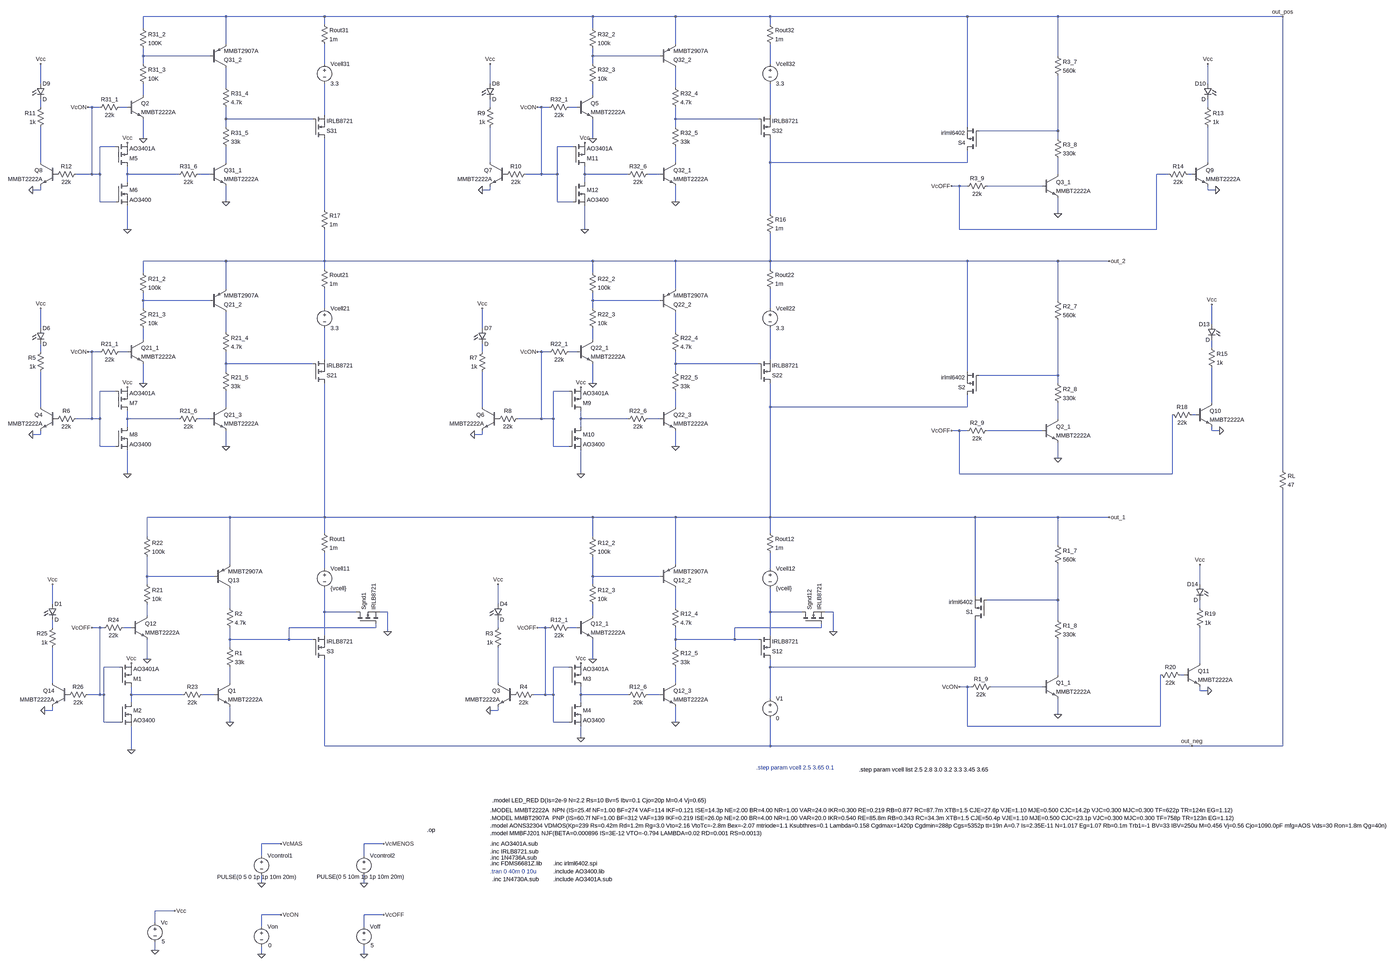
[diagram p0: schematic version_3x2.asc, whole sheet]
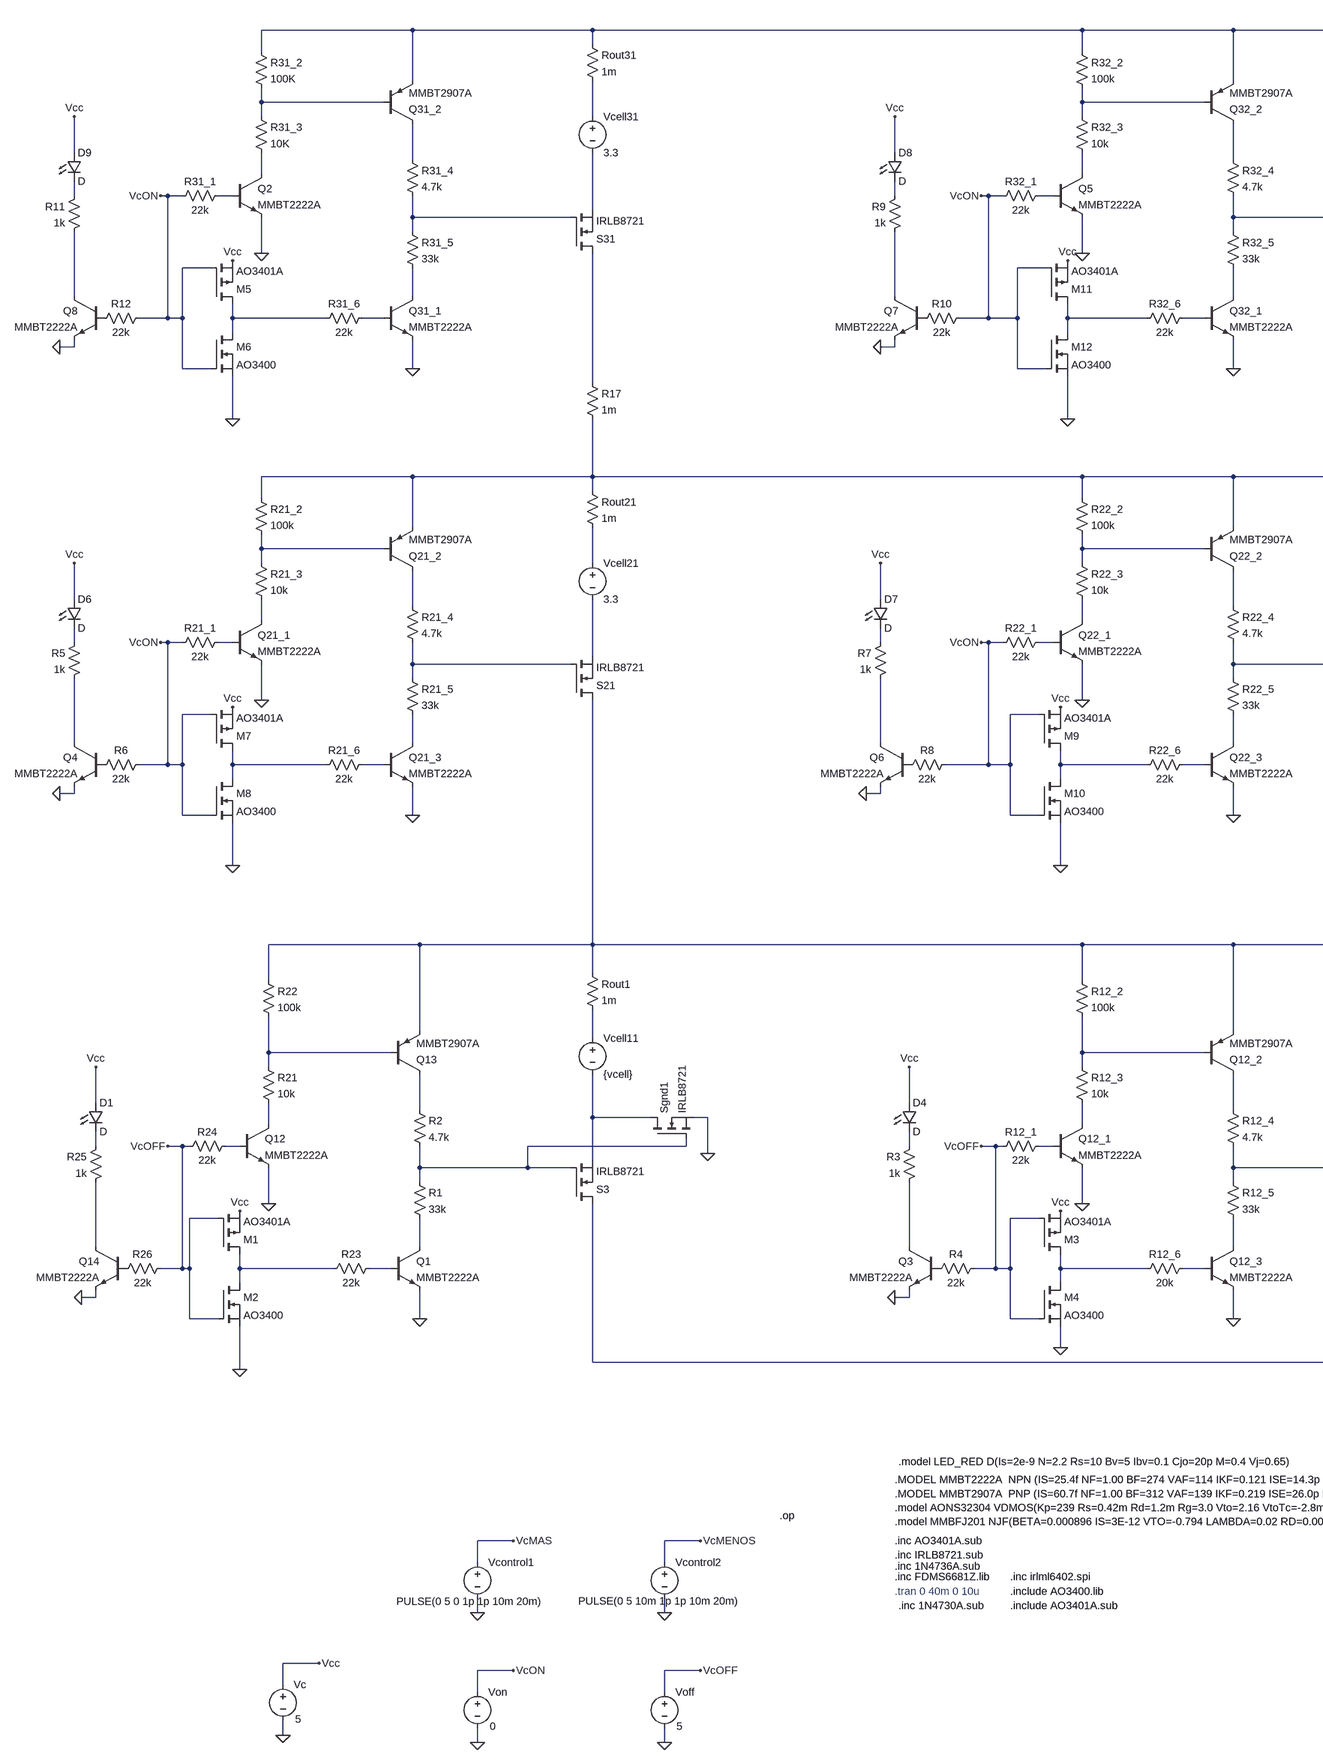
[diagram p1: schematic version_3x2.asc, part, row 1 of 1, column 1 of 2]
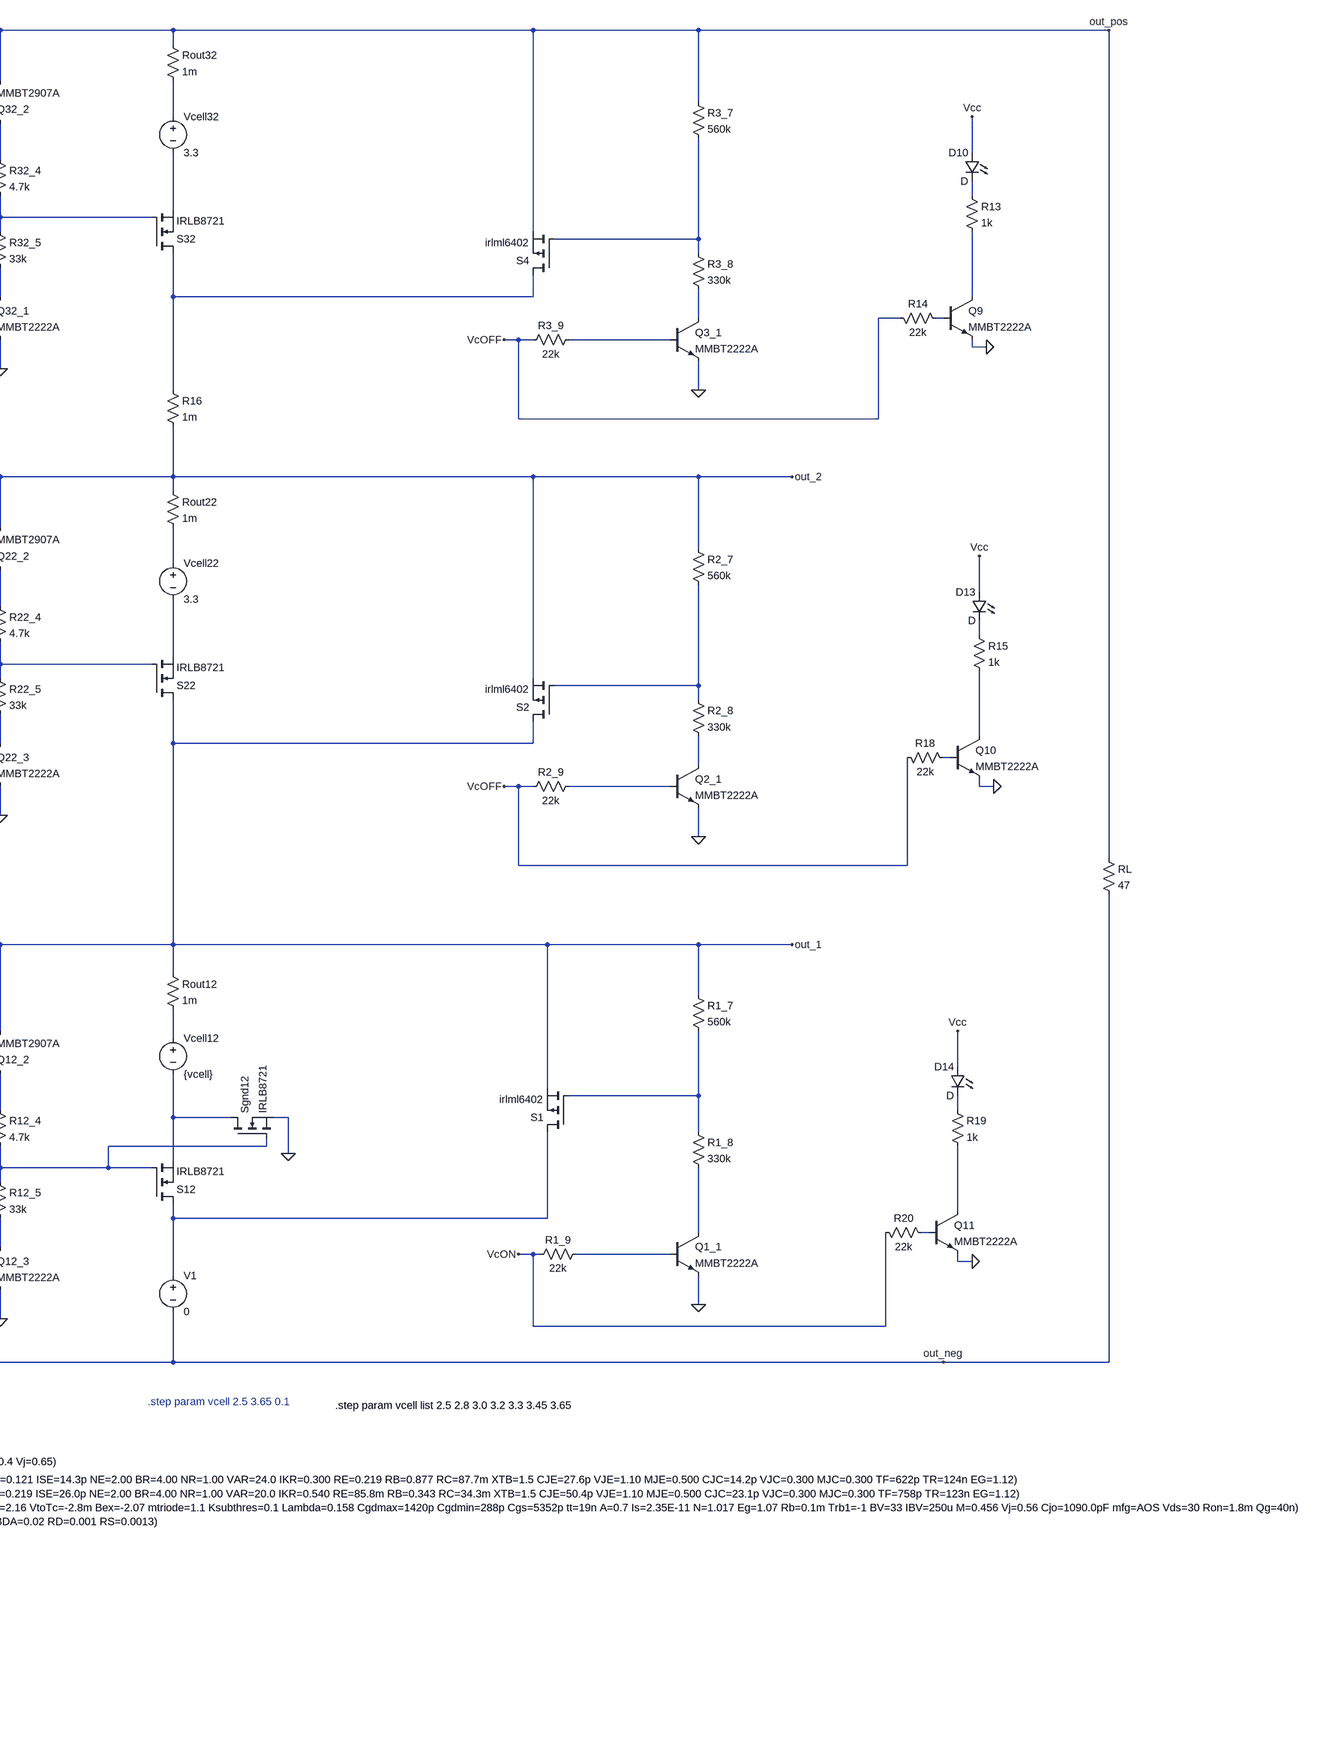
[diagram p2: schematic version_3x2.asc, part, row 1 of 1, column 2 of 2]
version_3x2.asc, the LTspice schematic file:
Version 4.1
SHEET 1 7672 2128
WIRE -1296 -2512 -1632 -2512
WIRE -896 -2512 -1296 -2512
WIRE 192 -2512 -896 -2512
WIRE 528 -2512 192 -2512
WIRE 912 -2512 528 -2512
WIRE 1712 -2512 912 -2512
WIRE 2080 -2512 1712 -2512
WIRE 2992 -2512 2080 -2512
WIRE -896 -2480 -896 -2512
WIRE 912 -2480 912 -2512
WIRE -1632 -2464 -1632 -2512
WIRE 192 -2464 192 -2512
WIRE -1296 -2400 -1296 -2512
WIRE 528 -2400 528 -2512
WIRE -1632 -2352 -1632 -2384
WIRE -1360 -2352 -1632 -2352
WIRE 192 -2352 192 -2384
WIRE 464 -2352 192 -2352
WIRE 2080 -2352 2080 -2512
WIRE -1632 -2320 -1632 -2352
WIRE -896 -2320 -896 -2400
WIRE 192 -2320 192 -2352
WIRE 912 -2320 912 -2400
WIRE -2048 -2240 -2048 -2320
WIRE -224 -2240 -224 -2320
WIRE 2688 -2240 2688 -2320
WIRE -1296 -2224 -1296 -2304
WIRE 528 -2224 528 -2304
WIRE -1632 -2192 -1632 -2240
WIRE 192 -2192 192 -2240
WIRE -2048 -2144 -2048 -2176
WIRE -1840 -2144 -1856 -2144
WIRE -1808 -2144 -1840 -2144
WIRE -1696 -2144 -1728 -2144
WIRE -224 -2144 -224 -2176
WIRE -16 -2144 -32 -2144
WIRE 16 -2144 -16 -2144
WIRE 128 -2144 96 -2144
WIRE 2688 -2144 2688 -2176
WIRE -896 -2112 -896 -2240
WIRE 912 -2112 912 -2240
WIRE -1296 -2096 -1296 -2144
WIRE -944 -2096 -1296 -2096
WIRE 528 -2096 528 -2144
WIRE 864 -2096 528 -2096
WIRE -1296 -2064 -1296 -2096
WIRE 528 -2064 528 -2096
WIRE 1712 -2064 1712 -2512
WIRE 2080 -2048 2080 -2272
WIRE 2080 -2048 1760 -2048
WIRE -1632 -2016 -1632 -2096
WIRE 192 -2016 192 -2096
WIRE 2080 -2016 2080 -2048
WIRE -1744 -1984 -1808 -1984
WIRE 112 -1984 48 -1984
WIRE -2048 -1920 -2048 -2064
WIRE -1296 -1920 -1296 -1984
WIRE -224 -1920 -224 -2064
WIRE 528 -1920 528 -1984
WIRE 912 -1920 912 -2016
WIRE 1712 -1920 1712 -1968
WIRE 1712 -1920 912 -1920
WIRE 2688 -1920 2688 -2064
WIRE -1840 -1872 -1840 -2144
WIRE -1840 -1872 -1904 -1872
WIRE -1808 -1872 -1808 -1984
WIRE -1808 -1872 -1840 -1872
WIRE -1696 -1872 -1696 -1904
WIRE -1488 -1872 -1696 -1872
WIRE -1360 -1872 -1408 -1872
WIRE -16 -1872 -16 -2144
WIRE -16 -1872 -80 -1872
WIRE 48 -1872 48 -1984
WIRE 48 -1872 -16 -1872
WIRE 160 -1872 160 -1904
WIRE 336 -1872 160 -1872
WIRE 464 -1872 416 -1872
WIRE 2080 -1872 2080 -1936
WIRE 2528 -1872 2480 -1872
WIRE 2624 -1872 2608 -1872
WIRE -1696 -1840 -1696 -1872
WIRE 160 -1840 160 -1872
WIRE 1680 -1824 1648 -1824
WIRE 1712 -1824 1680 -1824
WIRE 2016 -1824 1792 -1824
WIRE -2048 -1808 -2048 -1824
WIRE -2048 -1808 -2080 -1808
WIRE -224 -1808 -224 -1824
WIRE -224 -1808 -256 -1808
WIRE 2688 -1808 2688 -1824
WIRE 2720 -1808 2688 -1808
WIRE -1808 -1760 -1808 -1872
WIRE -1744 -1760 -1808 -1760
WIRE -1296 -1760 -1296 -1824
WIRE 48 -1760 48 -1872
WIRE 112 -1760 48 -1760
WIRE 528 -1760 528 -1824
WIRE -896 -1728 -896 -2016
WIRE 912 -1712 912 -1920
WIRE 2080 -1712 2080 -1776
WIRE -1696 -1648 -1696 -1744
WIRE 160 -1648 160 -1744
WIRE 1680 -1648 1680 -1824
WIRE 2480 -1648 2480 -1872
WIRE 2480 -1648 1680 -1648
WIRE -1296 -1456 -1632 -1456
WIRE -896 -1456 -896 -1648
WIRE -896 -1456 -1296 -1456
WIRE 192 -1456 -896 -1456
WIRE 528 -1456 192 -1456
WIRE 912 -1456 912 -1632
WIRE 912 -1456 528 -1456
WIRE 1712 -1456 912 -1456
WIRE 2080 -1456 1712 -1456
WIRE 2288 -1456 2080 -1456
WIRE -896 -1424 -896 -1456
WIRE 912 -1424 912 -1456
WIRE -1632 -1408 -1632 -1456
WIRE 192 -1408 192 -1456
WIRE -1296 -1344 -1296 -1456
WIRE 528 -1344 528 -1456
WIRE -1632 -1296 -1632 -1328
WIRE -1360 -1296 -1632 -1296
WIRE 192 -1296 192 -1328
WIRE 464 -1296 192 -1296
WIRE 2080 -1296 2080 -1456
WIRE -1632 -1264 -1632 -1296
WIRE -896 -1264 -896 -1344
WIRE 192 -1264 192 -1296
WIRE 912 -1264 912 -1344
WIRE 2704 -1200 2704 -1280
WIRE -2048 -1184 -2048 -1264
WIRE -256 -1184 -256 -1264
WIRE -1296 -1168 -1296 -1248
WIRE 528 -1168 528 -1248
WIRE -1632 -1136 -1632 -1184
WIRE 192 -1136 192 -1184
WIRE 2704 -1104 2704 -1136
WIRE -2048 -1088 -2048 -1120
WIRE -1840 -1088 -1856 -1088
WIRE -1808 -1088 -1840 -1088
WIRE -1696 -1088 -1728 -1088
WIRE -256 -1088 -256 -1120
WIRE -16 -1088 -32 -1088
WIRE 16 -1088 -16 -1088
WIRE 128 -1088 96 -1088
WIRE -896 -1056 -896 -1184
WIRE 912 -1056 912 -1184
WIRE -1296 -1040 -1296 -1088
WIRE -944 -1040 -1296 -1040
WIRE 528 -1040 528 -1088
WIRE 864 -1040 528 -1040
WIRE -1296 -1008 -1296 -1040
WIRE 528 -1008 528 -1040
WIRE 1712 -1008 1712 -1456
WIRE 2080 -992 2080 -1216
WIRE 2080 -992 1760 -992
WIRE -1632 -960 -1632 -1040
WIRE 192 -960 192 -1040
WIRE 2080 -960 2080 -992
WIRE -1744 -928 -1808 -928
WIRE 96 -928 32 -928
WIRE 2704 -880 2704 -1024
WIRE -2048 -864 -2048 -1008
WIRE -1296 -864 -1296 -928
WIRE -256 -864 -256 -1008
WIRE 528 -864 528 -928
WIRE 912 -864 912 -960
WIRE 1712 -864 1712 -912
WIRE 1712 -864 912 -864
WIRE 2640 -832 2624 -832
WIRE -1840 -816 -1840 -1088
WIRE -1840 -816 -1904 -816
WIRE -1808 -816 -1808 -928
WIRE -1808 -816 -1840 -816
WIRE -1696 -816 -1696 -848
WIRE -1488 -816 -1696 -816
WIRE -1360 -816 -1408 -816
WIRE -16 -816 -16 -1088
WIRE -16 -816 -112 -816
WIRE 32 -816 32 -928
WIRE 32 -816 -16 -816
WIRE 144 -816 144 -848
WIRE 336 -816 144 -816
WIRE 464 -816 416 -816
WIRE 2080 -816 2080 -880
WIRE -1696 -784 -1696 -816
WIRE 144 -784 144 -816
WIRE 1680 -768 1648 -768
WIRE 1712 -768 1680 -768
WIRE 2016 -768 1792 -768
WIRE 2704 -768 2704 -784
WIRE 2736 -768 2704 -768
WIRE -2048 -752 -2048 -768
WIRE -2048 -752 -2080 -752
WIRE -256 -752 -256 -768
WIRE -256 -752 -288 -752
WIRE -1808 -704 -1808 -816
WIRE -1744 -704 -1808 -704
WIRE -1296 -704 -1296 -768
WIRE 32 -704 32 -816
WIRE 96 -704 32 -704
WIRE 528 -704 528 -768
WIRE 2080 -656 2080 -720
WIRE 2992 -608 2992 -2512
WIRE -1696 -592 -1696 -688
WIRE 144 -592 144 -688
WIRE 1680 -592 1680 -768
WIRE 2544 -592 2544 -832
WIRE 2544 -592 1680 -592
WIRE -1280 -368 -1616 -368
WIRE -896 -368 -896 -960
WIRE -896 -368 -1280 -368
WIRE 192 -368 -896 -368
WIRE 528 -368 192 -368
WIRE 912 -368 912 -864
WIRE 912 -368 528 -368
WIRE 1744 -368 912 -368
WIRE 2080 -368 1744 -368
WIRE 2288 -368 2080 -368
WIRE -896 -304 -896 -368
WIRE 912 -304 912 -368
WIRE -1616 -288 -1616 -368
WIRE 192 -288 192 -368
WIRE 2080 -256 2080 -368
WIRE -1280 -176 -1280 -368
WIRE 528 -176 528 -368
WIRE -896 -160 -896 -224
WIRE 912 -160 912 -224
WIRE -1616 -128 -1616 -208
WIRE -1344 -128 -1616 -128
WIRE 192 -128 192 -208
WIRE 464 -128 192 -128
WIRE -1616 -96 -1616 -128
WIRE 192 -96 192 -128
WIRE 2656 -96 2656 -176
WIRE 1744 -48 1744 -368
WIRE 2080 -32 2080 -176
WIRE 2080 -32 1792 -32
WIRE -2000 -16 -2000 -96
WIRE -192 -16 -192 -96
WIRE -1280 0 -1280 -80
WIRE 528 0 528 -80
WIRE 2656 0 2656 -32
WIRE -896 16 -896 -80
WIRE -768 16 -896 16
WIRE -640 16 -672 16
WIRE 912 16 912 -80
WIRE 1040 16 912 16
WIRE 1168 16 1136 16
WIRE -1616 32 -1616 -16
WIRE 192 32 192 -16
WIRE 2080 48 2080 -32
WIRE -2000 80 -2000 48
WIRE -1808 80 -1840 80
WIRE -1792 80 -1808 80
WIRE -1680 80 -1712 80
WIRE -688 80 -688 64
WIRE -688 80 -1040 80
WIRE -192 80 -192 48
WIRE 0 80 -32 80
WIRE 16 80 0 80
WIRE 128 80 96 80
WIRE 1120 80 1120 64
WIRE 1120 80 768 80
WIRE -640 96 -640 16
WIRE 1168 96 1168 16
WIRE -896 112 -896 16
WIRE 912 112 912 16
WIRE -1280 128 -1280 80
WIRE -1040 128 -1040 80
WIRE -1040 128 -1280 128
WIRE -944 128 -1040 128
WIRE 528 128 528 80
WIRE 768 128 768 80
WIRE 768 128 528 128
WIRE 864 128 768 128
WIRE -1280 160 -1280 128
WIRE 528 160 528 128
WIRE -1616 208 -1616 128
WIRE 192 208 192 128
WIRE 2656 224 2656 80
WIRE -1728 240 -1792 240
WIRE 96 240 32 240
WIRE 912 240 912 208
WIRE 1744 240 1744 48
WIRE 1744 240 912 240
WIRE 2080 272 2080 128
WIRE 2592 272 2576 272
WIRE -2000 304 -2000 160
WIRE -1280 304 -1280 240
WIRE -192 304 -192 160
WIRE 528 304 528 240
WIRE 1712 320 1680 320
WIRE 1728 320 1712 320
WIRE 2016 320 1808 320
WIRE 2656 336 2656 320
WIRE 2688 336 2656 336
WIRE -1808 352 -1808 80
WIRE -1808 352 -1856 352
WIRE -1792 352 -1792 240
WIRE -1792 352 -1808 352
WIRE -1680 352 -1680 320
WIRE -1472 352 -1680 352
WIRE -1344 352 -1392 352
WIRE 0 352 0 80
WIRE 0 352 -48 352
WIRE 32 352 32 240
WIRE 32 352 0 352
WIRE 144 352 144 320
WIRE 336 352 144 352
WIRE 464 352 416 352
WIRE 912 368 912 240
WIRE -1680 384 -1680 352
WIRE 144 384 144 352
WIRE -2000 416 -2000 400
WIRE -2000 416 -2032 416
WIRE -192 416 -192 400
WIRE -192 416 -224 416
WIRE 2080 432 2080 368
WIRE -1792 464 -1792 352
WIRE -1728 464 -1792 464
WIRE -1280 464 -1280 400
WIRE 32 464 32 352
WIRE 96 464 32 464
WIRE 528 464 528 400
WIRE 1712 480 1712 320
WIRE 2496 480 2496 272
WIRE 2496 480 1712 480
WIRE 144 528 144 480
WIRE -896 560 -896 208
WIRE 912 560 912 448
WIRE 912 560 -896 560
WIRE 2624 560 912 560
WIRE 2992 560 2992 -528
WIRE 2992 560 2624 560
WIRE -1680 576 -1680 480
WIRE -1072 1024 -1152 1024
WIRE -656 1024 -736 1024
WIRE -1152 1072 -1152 1024
WIRE -736 1072 -736 1024
WIRE -1152 1184 -1152 1152
WIRE -736 1184 -736 1152
WIRE -1504 1296 -1584 1296
WIRE -1072 1312 -1152 1312
WIRE -656 1312 -736 1312
WIRE -1584 1344 -1584 1296
WIRE -1152 1360 -1152 1312
WIRE -736 1360 -736 1312
WIRE -1584 1456 -1584 1424
WIRE -1152 1472 -1152 1440
WIRE -736 1472 -736 1440
FLAG 192 208 0
FLAG 528 464 0
FLAG -1632 -960 0
FLAG -1296 -704 0
FLAG 192 -960 0
FLAG 528 -704 0
FLAG -1152 1184 0
FLAG -736 1184 0
FLAG -1072 1024 VcMAS
FLAG -656 1024 VcMENOS
FLAG -736 1472 0
FLAG -656 1312 VcOFF
FLAG -1152 1472 0
FLAG -1072 1312 VcON
FLAG -1856 -1088 VcON
FLAG -32 -1088 VcON
FLAG -32 80 VcOFF
FLAG 2624 560 out_neg
FLAG 2288 -368 out_1
FLAG 2080 432 0
FLAG 1680 320 VcON
FLAG 2080 -656 0
FLAG 1648 -768 VcOFF
FLAG 2992 -2512 out_pos
FLAG 1168 96 0
FLAG -1632 -2016 0
FLAG -1296 -1760 0
FLAG 192 -2016 0
FLAG 528 -1760 0
FLAG -1856 -2144 VcON
FLAG -32 -2144 VcON
FLAG 2080 -1712 0
FLAG 1648 -1824 VcOFF
FLAG 2288 -1456 out_2
FLAG -224 416 0
FLAG -2080 -752 0
FLAG -288 -752 0
FLAG -256 -1808 0
FLAG -2080 -1808 0
FLAG 2720 -1808 0
FLAG 2736 -768 0
FLAG 2688 336 0
FLAG 2656 -176 Vcc
FLAG -192 -96 Vcc
FLAG -256 -1264 Vcc
FLAG -2048 -1264 Vcc
FLAG 2704 -1280 Vcc
FLAG 2688 -2320 Vcc
FLAG -224 -2320 Vcc
FLAG -2048 -2320 Vcc
FLAG -1616 208 0
FLAG -1280 464 0
FLAG -1840 80 VcOFF
FLAG -640 96 0
FLAG -2032 416 0
FLAG -2000 -96 Vcc
FLAG -1680 576 0
FLAG -1680 224 Vcc
FLAG -1584 1456 0
FLAG -1504 1296 Vcc
FLAG 144 528 0
FLAG 144 224 Vcc
FLAG -1696 -1648 0
FLAG -1696 -2000 Vcc
FLAG -1696 -592 0
FLAG -1696 -944 Vcc
FLAG 144 -592 0
FLAG 144 -944 Vcc
FLAG 160 -1648 0
FLAG 160 -2000 Vcc
SYMBOL npn 464 304 R0
SYMATTR InstName Q12_3
SYMATTR Value MMBT2222A
SYMBOL res 512 144 R0
SYMATTR InstName R12_5
SYMATTR Value 33k
SYMBOL res 512 -16 R0
SYMATTR InstName R12_4
SYMATTR Value 4.7k
SYMBOL npn 128 32 R0
SYMATTR InstName Q12_1
SYMATTR Value MMBT2222A
SYMBOL res 176 -112 R0
SYMATTR InstName R12_3
SYMATTR Value 10k
SYMBOL res 176 -304 R0
SYMATTR InstName R12_2
SYMATTR Value 100k
SYMBOL res 432 336 R90
WINDOW 0 0 56 VBottom 2
WINDOW 3 32 56 VTop 2
SYMATTR InstName R12_6
SYMATTR Value 20k
SYMBOL voltage 912 -176 R0
WINDOW 123 0 0 Left 0
WINDOW 39 0 0 Left 0
SYMATTR InstName Vcell12
SYMATTR Value {vcell}
SYMBOL pnp 464 -80 M180
SYMATTR InstName Q12_2
SYMATTR Value MMBT2907A
SYMBOL nmos 864 208 M180
SYMATTR InstName S12
SYMATTR Value IRLB8721
SYMATTR Prefix X
SYMBOL npn -1360 -864 R0
SYMATTR InstName Q21_3
SYMATTR Value MMBT2222A
SYMBOL res -1312 -1024 R0
SYMATTR InstName R21_5
SYMATTR Value 33k
SYMBOL res -1312 -1184 R0
SYMATTR InstName R21_4
SYMATTR Value 4.7k
SYMBOL npn -1696 -1136 R0
SYMATTR InstName Q21_1
SYMATTR Value MMBT2222A
SYMBOL res -1648 -1280 R0
SYMATTR InstName R21_3
SYMATTR Value 10k
SYMBOL res -1648 -1424 R0
SYMATTR InstName R21_2
SYMATTR Value 100k
SYMBOL res -1392 -832 R90
WINDOW 0 0 56 VBottom 2
WINDOW 3 32 56 VTop 2
SYMATTR InstName R21_6
SYMATTR Value 22k
SYMBOL voltage -896 -1280 R0
WINDOW 123 0 0 Left 0
WINDOW 39 0 0 Left 0
SYMATTR InstName Vcell21
SYMATTR Value 3.3
SYMBOL pnp -1360 -1248 M180
SYMATTR InstName Q21_2
SYMATTR Value MMBT2907A
SYMBOL nmos -944 -960 M180
SYMATTR InstName S21
SYMATTR Value IRLB8721
SYMATTR Prefix X
SYMBOL npn 464 -864 R0
SYMATTR InstName Q22_3
SYMATTR Value MMBT2222A
SYMBOL res 512 -1024 R0
SYMATTR InstName R22_5
SYMATTR Value 33k
SYMBOL res 512 -1184 R0
SYMATTR InstName R22_4
SYMATTR Value 4.7k
SYMBOL npn 128 -1136 R0
SYMATTR InstName Q22_1
SYMATTR Value MMBT2222A
SYMBOL res 176 -1280 R0
SYMATTR InstName R22_3
SYMATTR Value 10k
SYMBOL res 176 -1424 R0
SYMATTR InstName R22_2
SYMATTR Value 100k
SYMBOL res 432 -832 R90
WINDOW 0 0 56 VBottom 2
WINDOW 3 32 56 VTop 2
SYMATTR InstName R22_6
SYMATTR Value 22k
SYMBOL voltage 912 -1280 R0
WINDOW 123 0 0 Left 0
WINDOW 39 0 0 Left 0
SYMATTR InstName Vcell22
SYMATTR Value 3.3
SYMBOL pnp 464 -1248 M180
SYMATTR InstName Q22_2
SYMATTR Value MMBT2907A
SYMBOL nmos 864 -960 M180
SYMATTR InstName S22
SYMATTR Value IRLB8721
SYMATTR Prefix X
SYMBOL voltage -1152 1056 R0
WINDOW 3 -180 103 Left 2
WINDOW 123 0 0 Left 0
WINDOW 39 0 0 Left 0
SYMATTR Value PULSE(0 5 0 1p 1p 10m 20m)
SYMATTR InstName Vcontrol1
SYMBOL voltage -736 1056 R0
WINDOW 3 -192 102 Left 2
WINDOW 123 0 0 Left 0
WINDOW 39 0 0 Left 0
SYMATTR Value PULSE(0 5 10m 1p 1p 10m 20m)
SYMATTR InstName Vcontrol2
SYMBOL voltage -736 1344 R0
WINDOW 3 27 92 Left 2
WINDOW 123 0 0 Left 0
WINDOW 39 0 0 Left 0
SYMATTR Value 5
SYMATTR InstName Voff
SYMBOL voltage -1152 1344 R0
WINDOW 3 28 92 Left 2
WINDOW 123 0 0 Left 0
WINDOW 39 0 0 Left 0
SYMATTR Value 0
SYMATTR InstName Von
SYMBOL res -1712 -1104 R90
WINDOW 0 0 56 VBottom 2
WINDOW 3 32 56 VTop 2
SYMATTR InstName R21_1
SYMATTR Value 22k
SYMBOL res 112 -1104 R90
WINDOW 0 0 56 VBottom 2
WINDOW 3 32 56 VTop 2
SYMATTR InstName R22_1
SYMATTR Value 22k
SYMBOL res 112 64 R90
WINDOW 0 0 56 VBottom 2
WINDOW 3 32 56 VTop 2
SYMATTR InstName R12_1
SYMATTR Value 22k
SYMBOL res 896 -320 R0
SYMATTR InstName Rout12
SYMATTR Value 1m
SYMBOL res -912 -1440 R0
SYMATTR InstName Rout21
SYMATTR Value 1m
SYMBOL res 896 -1440 R0
SYMATTR InstName Rout22
SYMATTR Value 1m
SYMBOL npn 2016 272 R0
SYMATTR InstName Q1_1
SYMATTR Value MMBT2222A
SYMBOL res 1824 304 R90
WINDOW 0 0 56 VBottom 2
WINDOW 3 32 56 VTop 2
SYMATTR InstName R1_9
SYMATTR Value 22k
SYMBOL res 2064 -272 R0
SYMATTR InstName R1_7
SYMATTR Value 560k
SYMBOL npn 2016 -816 R0
SYMATTR InstName Q2_1
SYMATTR Value MMBT2222A
SYMBOL res 1808 -784 R90
WINDOW 0 0 56 VBottom 2
WINDOW 3 32 56 VTop 2
SYMATTR InstName R2_9
SYMATTR Value 22k
SYMBOL res 2064 -1312 R0
SYMATTR InstName R2_7
SYMATTR Value 560k
SYMBOL nmos 1040 64 R270
SYMATTR InstName Sgnd12
SYMATTR Value IRLB8721
SYMATTR Prefix X
SYMBOL npn -1360 -1920 R0
SYMATTR InstName Q31_1
SYMATTR Value MMBT2222A
SYMBOL res -1312 -2080 R0
SYMATTR InstName R31_5
SYMATTR Value 33k
SYMBOL res -1312 -2240 R0
SYMATTR InstName R31_4
SYMATTR Value 4.7k
SYMBOL npn -1696 -2192 R0
SYMATTR InstName Q2
SYMATTR Value MMBT2222A
SYMBOL res -1648 -2336 R0
SYMATTR InstName R31_3
SYMATTR Value 10K
SYMBOL res -1648 -2480 R0
SYMATTR InstName R31_2
SYMATTR Value 100K
SYMBOL res -1392 -1888 R90
WINDOW 0 0 56 VBottom 2
WINDOW 3 32 56 VTop 2
SYMATTR InstName R31_6
SYMATTR Value 22k
SYMBOL voltage -896 -2336 R0
WINDOW 123 0 0 Left 0
WINDOW 39 0 0 Left 0
SYMATTR InstName Vcell31
SYMATTR Value 3.3
SYMBOL pnp -1360 -2304 M180
SYMATTR InstName Q31_2
SYMATTR Value MMBT2907A
SYMBOL nmos -944 -2016 M180
SYMATTR InstName S31
SYMATTR Value IRLB8721
SYMATTR Prefix X
SYMBOL npn 464 -1920 R0
SYMATTR InstName Q32_1
SYMATTR Value MMBT2222A
SYMBOL res 512 -2080 R0
SYMATTR InstName R32_5
SYMATTR Value 33k
SYMBOL res 512 -2240 R0
SYMATTR InstName R32_4
SYMATTR Value 4.7k
SYMBOL npn 128 -2192 R0
SYMATTR InstName Q5
SYMATTR Value MMBT2222A
SYMBOL res 176 -2336 R0
SYMATTR InstName R32_3
SYMATTR Value 10k
SYMBOL res 176 -2480 R0
SYMATTR InstName R32_2
SYMATTR Value 100k
SYMBOL res 432 -1888 R90
WINDOW 0 0 56 VBottom 2
WINDOW 3 32 56 VTop 2
SYMATTR InstName R32_6
SYMATTR Value 22k
SYMBOL voltage 912 -2336 R0
WINDOW 123 0 0 Left 0
WINDOW 39 0 0 Left 0
SYMATTR InstName Vcell32
SYMATTR Value 3.3
SYMBOL pnp 464 -2304 M180
SYMATTR InstName Q32_2
SYMATTR Value MMBT2907A
SYMBOL nmos 864 -2016 M180
SYMATTR InstName S32
SYMATTR Value IRLB8721
SYMATTR Prefix X
SYMBOL res -1712 -2160 R90
WINDOW 0 0 56 VBottom 2
WINDOW 3 32 56 VTop 2
SYMATTR InstName R31_1
SYMATTR Value 22k
SYMBOL res 112 -2160 R90
WINDOW 0 0 56 VBottom 2
WINDOW 3 32 56 VTop 2
SYMATTR InstName R32_1
SYMATTR Value 22k
SYMBOL res -912 -2496 R0
SYMATTR InstName Rout31
SYMATTR Value 1m
SYMBOL res 896 -2496 R0
SYMATTR InstName Rout32
SYMATTR Value 1m
SYMBOL npn 2016 -1872 R0
SYMATTR InstName Q3_1
SYMATTR Value MMBT2222A
SYMBOL res 1808 -1840 R90
WINDOW 0 0 56 VBottom 2
WINDOW 3 32 56 VTop 2
SYMATTR InstName R3_9
SYMATTR Value 22k
SYMBOL res 2064 -2368 R0
SYMATTR InstName R3_7
SYMATTR Value 560k
SYMBOL res 896 -1728 R0
SYMATTR InstName R16
SYMATTR Value 1m
SYMBOL res -912 -1744 R0
SYMATTR InstName R17
SYMATTR Value 1m
SYMBOL pmos 1760 -1968 R180
SYMATTR InstName S4
SYMATTR Value irlml6402
SYMATTR Prefix X
SYMBOL pmos 1760 -912 R180
SYMATTR InstName S2
SYMATTR Value irlml6402
SYMATTR Prefix X
SYMBOL pmos 1792 48 R180
SYMATTR InstName S1
SYMATTR Value irlml6402
SYMATTR Prefix X
SYMBOL voltage 912 352 R0
WINDOW 123 0 0 Left 0
WINDOW 39 0 0 Left 0
SYMATTR InstName V1
SYMATTR Value 0
SYMBOL npn -128 304 M0
SYMATTR InstName Q3
SYMATTR Value MMBT2222A
SYMBOL res -176 64 M0
SYMATTR InstName R3
SYMATTR Value 1k
SYMBOL res -32 336 R90
WINDOW 0 0 56 VBottom 2
WINDOW 3 32 56 VTop 2
SYMATTR InstName R4
SYMATTR Value 22k
SYMBOL LED -208 -16 R0
SYMATTR InstName D4
SYMBOL npn -1984 -864 M0
SYMATTR InstName Q4
SYMATTR Value MMBT2222A
SYMBOL res -2032 -1104 M0
SYMATTR InstName R5
SYMATTR Value 1k
SYMBOL res -1888 -832 R90
WINDOW 0 0 56 VBottom 2
WINDOW 3 32 56 VTop 2
SYMATTR InstName R6
SYMATTR Value 22k
SYMBOL LED -2064 -1184 R0
SYMATTR InstName D6
SYMBOL npn -192 -864 M0
SYMATTR InstName Q6
SYMATTR Value MMBT2222A
SYMBOL res -240 -1104 M0
SYMATTR InstName R7
SYMATTR Value 1k
SYMBOL res -96 -832 R90
WINDOW 0 0 56 VBottom 2
WINDOW 3 32 56 VTop 2
SYMATTR InstName R8
SYMATTR Value 22k
SYMBOL LED -272 -1184 R0
SYMATTR InstName D7
SYMBOL npn -160 -1920 M0
SYMATTR InstName Q7
SYMATTR Value MMBT2222A
SYMBOL res -208 -2160 M0
SYMATTR InstName R9
SYMATTR Value 1k
SYMBOL res -64 -1888 R90
WINDOW 0 0 56 VBottom 2
WINDOW 3 32 56 VTop 2
SYMATTR InstName R10
SYMATTR Value 22k
SYMBOL LED -240 -2240 R0
SYMATTR InstName D8
SYMBOL npn -1984 -1920 M0
SYMATTR InstName Q8
SYMATTR Value MMBT2222A
SYMBOL res -2032 -2160 M0
SYMATTR InstName R11
SYMATTR Value 1k
SYMBOL res -1888 -1888 R90
WINDOW 0 0 56 VBottom 2
WINDOW 3 32 56 VTop 2
SYMATTR InstName R12
SYMATTR Value 22k
SYMBOL LED -2064 -2240 R0
SYMATTR InstName D9
SYMBOL npn 2624 -1920 R0
SYMATTR InstName Q9
SYMATTR Value MMBT2222A
SYMBOL res 2672 -2160 R0
SYMATTR InstName R13
SYMATTR Value 1k
SYMBOL res 2512 -1888 M90
WINDOW 0 0 56 VBottom 2
WINDOW 3 32 56 VTop 2
SYMATTR InstName R14
SYMATTR Value 22k
SYMBOL LED 2704 -2240 M0
SYMATTR InstName D10
SYMBOL npn 2640 -880 R0
SYMATTR InstName Q10
SYMATTR Value MMBT2222A
SYMBOL res 2688 -1120 R0
SYMATTR InstName R15
SYMATTR Value 1k
SYMBOL res 2528 -848 M90
WINDOW 0 0 56 VBottom 2
WINDOW 3 32 56 VTop 2
SYMATTR InstName R18
SYMATTR Value 22k
SYMBOL LED 2720 -1200 M0
SYMATTR InstName D13
SYMBOL npn 2592 224 R0
SYMATTR InstName Q11
SYMATTR Value MMBT2222A
SYMBOL res 2640 -16 R0
SYMATTR InstName R19
SYMATTR Value 1k
SYMBOL res 2480 256 M90
WINDOW 0 0 56 VBottom 2
WINDOW 3 32 56 VTop 2
SYMATTR InstName R20
SYMATTR Value 22k
SYMBOL LED 2672 -96 M0
SYMATTR InstName D14
SYMBOL res 2064 32 R0
SYMATTR InstName R1_8
SYMATTR Value 330k
SYMBOL res 2064 -976 R0
SYMATTR InstName R2_8
SYMATTR Value 330k
SYMBOL res 2064 -2032 R0
SYMATTR InstName R3_8
SYMATTR Value 330k
SYMBOL npn -1344 304 R0
SYMATTR InstName Q1
SYMATTR Value MMBT2222A
SYMBOL res -1296 144 R0
SYMATTR InstName R1
SYMATTR Value 33k
SYMBOL res -1296 -16 R0
SYMATTR InstName R2
SYMATTR Value 4.7k
SYMBOL npn -1680 32 R0
SYMATTR InstName Q12
SYMATTR Value MMBT2222A
SYMBOL res -1632 -112 R0
SYMATTR InstName R21
SYMATTR Value 10k
SYMBOL res -1632 -304 R0
SYMATTR InstName R22
SYMATTR Value 100k
SYMBOL res -1376 336 R90
WINDOW 0 0 56 VBottom 2
WINDOW 3 32 56 VTop 2
SYMATTR InstName R23
SYMATTR Value 22k
SYMBOL voltage -896 -176 R0
WINDOW 123 0 0 Left 0
WINDOW 39 0 0 Left 0
SYMATTR InstName Vcell11
SYMATTR Value {vcell}
SYMBOL pnp -1344 -80 M180
SYMATTR InstName Q13
SYMATTR Value MMBT2907A
SYMBOL nmos -944 208 M180
SYMATTR InstName S3
SYMATTR Value IRLB8721
SYMATTR Prefix X
SYMBOL res -1696 64 R90
WINDOW 0 0 56 VBottom 2
WINDOW 3 32 56 VTop 2
SYMATTR InstName R24
SYMATTR Value 22k
SYMBOL res -912 -320 R0
SYMATTR InstName Rout1
SYMATTR Value 1m
SYMBOL nmos -768 64 R270
SYMATTR InstName Sgnd1
SYMATTR Value IRLB8721
SYMATTR Prefix X
SYMBOL npn -1936 304 M0
SYMATTR InstName Q14
SYMATTR Value MMBT2222A
SYMBOL res -1984 64 M0
SYMATTR InstName R25
SYMATTR Value 1k
SYMBOL res -1840 336 R90
WINDOW 0 0 56 VBottom 2
WINDOW 3 32 56 VTop 2
SYMATTR InstName R26
SYMATTR Value 22k
SYMBOL LED -2016 -16 R0
SYMATTR InstName D1
SYMBOL res 2976 -624 R0
SYMATTR InstName RL
SYMATTR Value 47
SYMBOL pmos -1728 320 M180
SYMATTR InstName M1
SYMATTR Value AO3401A
SYMATTR Prefix X
SYMBOL nmos -1728 384 R0
SYMATTR InstName M2
SYMATTR Value AO3400
SYMATTR Prefix X
SYMBOL voltage -1584 1328 R0
WINDOW 3 27 92 Left 2
WINDOW 123 0 0 Left 0
WINDOW 39 0 0 Left 0
SYMATTR Value 5
SYMATTR InstName Vc
SYMBOL pmos 96 320 M180
SYMATTR InstName M3
SYMATTR Value AO3401A
SYMATTR Prefix X
SYMBOL nmos 96 384 R0
SYMATTR InstName M4
SYMATTR Value AO3400
SYMATTR Prefix X
SYMBOL pmos -1744 -1904 M180
SYMATTR InstName M5
SYMATTR Value AO3401A
SYMATTR Prefix X
SYMBOL nmos -1744 -1840 R0
SYMATTR InstName M6
SYMATTR Value AO3400
SYMATTR Prefix X
SYMBOL pmos -1744 -848 M180
SYMATTR InstName M7
SYMATTR Value AO3401A
SYMATTR Prefix X
SYMBOL nmos -1744 -784 R0
SYMATTR InstName M8
SYMATTR Value AO3400
SYMATTR Prefix X
SYMBOL pmos 96 -848 M180
SYMATTR InstName M9
SYMATTR Value AO3401A
SYMATTR Prefix X
SYMBOL nmos 96 -784 R0
SYMATTR InstName M10
SYMATTR Value AO3400
SYMATTR Prefix X
SYMBOL pmos 112 -1904 M180
SYMATTR InstName M11
SYMATTR Value AO3401A
SYMATTR Prefix X
SYMBOL nmos 112 -1840 R0
SYMATTR InstName M12
SYMATTR Value AO3400
SYMATTR Prefix X
TEXT -224 1136 Left 2 ;.tran 0 40m 0 10u
TEXT -224 888 Left 2 !.MODEL MMBT2222A  NPN (IS=25.4f NF=1.00 BF=274 VAF=114 IKF=0.121 ISE=14.3p NE=2.00 BR=4.00 NR=1.00 VAR=24.0 IKR=0.300 RE=0.219 RB=0.877 RC=87.7m XTB=1.5 CJE=27.6p VJE=1.10 MJE=0.500 CJC=14.2p VJC=0.300 MJC=0.300 TF=622p TR=124n EG=1.12)\n.MODEL MMBT2907A  PNP (IS=60.7f NF=1.00 BF=312 VAF=139 IKF=0.219 ISE=26.0p NE=2.00 BR=4.00 NR=1.00 VAR=20.0 IKR=0.540 RE=85.8m RB=0.343 RC=34.3m XTB=1.5 CJE=50.4p VJE=1.10 MJE=0.500 CJC=23.1p VJC=0.300 MJC=0.300 TF=758p TR=123n EG=1.12)\n.model AONS32304 VDMOS(Kp=239 Rs=0.42m Rd=1.2m Rg=3.0 Vto=2.16 VtoTc=-2.8m Bex=-2.07 mtriode=1.1 Ksubthres=0.1 Lambda=0.158 Cgdmax=1420p Cgdmin=288p Cgs=5352p tt=19n A=0.7 Is=2.35E-11 N=1.017 Eg=1.07 Rb=0.1m Trb1=-1 BV=33 IBV=250u M=0.456 Vj=0.56 Cjo=1090.0pF mfg=AOS Vds=30 Ron=1.8m Qg=40n)\n.model MMBFJ201 NJF(BETA=0.000896 IS=3E-12 VTO=-0.794 LAMBDA=0.02 RD=0.001 RS=0.0013)
TEXT -224 1024 Left 2 !.inc AO3401A.sub\n.inc IRLB8721.sub
TEXT -224 1080 Left 2 !.inc 1N4736A.sub
TEXT -224 1104 Left 2 !.inc FDMS6681Z.lib
TEXT -216 1168 Left 2 !.inc 1N4730A.sub
TEXT -216 848 Left 2 !.model LED_RED D(Is=2e-9 N=2.2 Rs=10 Bv=5 Ibv=0.1 Cjo=20p M=0.4 Vj=0.65)
TEXT 32 1104 Left 2 !.inc irlml6402.spi
TEXT 32 1136 Left 2 !.include AO3400.lib
TEXT 32 1168 Left 2 !.include AO3401A.sub
TEXT -480 968 Left 2 !.op
TEXT 856 648 Left 2 ;.step param vcell 2.5 3.65 0.1
TEXT 1272 656 Left 2 !.step param vcell list 2.5 2.8 3.0 3.2 3.3 3.45 3.65

The netlist it stands for:
* version_3x2.asc
Q12_3 N088 N093 0 0 MMBT2222A
R12_5 N080 N088 33k
R12_4 N069 N080 4.7k
Q12_1 N074 N079 0 0 MMBT2222A
R12_3 N066 N074 10k
R12_2 out_1 N066 100k
R12_6 N093 N092 20k
Vcell12 N064 N072 {vcell}
Q12_2 N069 N066 out_1 0 MMBT2907A
X§S12 N082 N080 N072 IRLB8721  ; pins D G S
Q21_3 N053 N058 0 0 MMBT2222A
R21_5 N048 N053 33k
R21_4 N037 N048 4.7k
Q21_1 N039 N043 0 0 MMBT2222A
R21_3 N033 N039 10k
R21_2 out_2 N033 100k
R21_6 N058 N057 22k
Vcell21 N035 N046 3.3
Q21_2 N037 N033 out_2 0 MMBT2907A
X§S21 out_1 N048 N046 IRLB8721  ; pins D G S
Q22_3 N055 N060 0 0 MMBT2222A
R22_5 N049 N055 33k
R22_4 N038 N049 4.7k
Q22_1 N040 N045 0 0 MMBT2222A
R22_3 N034 N040 10k
R22_2 out_2 N034 100k
R22_6 N060 N059 22k
Vcell22 N036 N047 3.3
Q22_2 N038 N034 out_2 0 MMBT2907A
X§S22 out_1 N049 N047 IRLB8721  ; pins D G S
Vcontrol1 VcMAS 0 PULSE(0 5 0 1p 1p 10m 20m)
Vcontrol2 VcMENOS 0 PULSE(0 5 10m 1p 1p 10m 20m)
Voff VcOFF 0 5
Von VcON 0 0
R21_1 N043 VcON 22k
R22_1 N045 VcON 22k
R12_1 N079 VcOFF 22k
Rout12 out_1 N064 1m
Rout21 out_2 N035 1m
Rout22 out_2 N036 1m
Q1_1 N083 N089 0 0 MMBT2222A
R1_9 N089 VcON 22k
R1_7 out_1 N067 560k
Q2_1 N061 N062 0 0 MMBT2222A
R2_9 N062 VcOFF 22k
R2_7 out_2 N050 560k
X§Sgnd12 N072 N080 0 IRLB8721  ; pins D G S
Q31_1 N020 N026 0 0 MMBT2222A
R31_5 N016 N020 33k
R31_4 N005 N016 4.7k
Q2 N007 N010 0 0 MMBT2222A
R31_3 N001 N007 10K
R31_2 out_pos N001 100K
R31_6 N026 N025 22k
Vcell31 N003 N014 3.3
Q31_2 N005 N001 out_pos 0 MMBT2907A
X§S31 N032 N016 N014 IRLB8721  ; pins D G S
Q32_1 N022 N028 0 0 MMBT2222A
R32_5 N017 N022 33k
R32_4 N006 N017 4.7k
Q5 N008 N012 0 0 MMBT2222A
R32_3 N002 N008 10k
R32_2 out_pos N002 100k
R32_6 N028 N027 22k
Vcell32 N004 N015 3.3
Q32_2 N006 N002 out_pos 0 MMBT2907A
X§S32 N023 N017 N015 IRLB8721  ; pins D G S
R31_1 N010 VcON 22k
R32_1 N012 VcON 22k
Rout31 out_pos N003 1m
Rout32 out_pos N004 1m
Q3_1 N029 N031 0 0 MMBT2222A
R3_9 N031 VcOFF 22k
R3_7 out_pos N018 560k
R16 N023 out_2 1m
R17 N032 out_2 1m
X§S4 N023 N018 out_pos irlml6402  ; pins D G S
X§S2 out_1 N050 out_2 irlml6402  ; pins D G S
X§S1 N082 N067 out_1 irlml6402  ; pins D G S
V1 N082 out_neg 0
Q3 N087 P001 0 0 MMBT2222A
R3 N078 N087 1k
R4 VcOFF P001 22k
D4 Vcc N078 D
Q4 N052 P002 0 0 MMBT2222A
R5 N042 N052 1k
R6 VcON P002 22k
D6 Vcc N042 D
Q6 N054 P003 0 0 MMBT2222A
R7 N044 N054 1k
R8 VcON P003 22k
D7 Vcc N044 D
Q7 N021 P004 0 0 MMBT2222A
R9 N011 N021 1k
R10 VcON P004 22k
D8 Vcc N011 D
Q8 N019 P005 0 0 MMBT2222A
R11 N009 N019 1k
R12 VcON P005 22k
D9 Vcc N009 D
Q9 N024 N030 0 0 MMBT2222A
R13 N013 N024 1k
R14 VcOFF N030 22k
D10 Vcc N013 D
Q10 N051 N056 0 0 MMBT2222A
R15 N041 N051 1k
R18 VcOFF N056 22k
D13 Vcc N041 D
Q11 N081 N084 0 0 MMBT2222A
R19 N070 N081 1k
R20 VcON N084 22k
D14 Vcc N070 D
R1_8 N067 N083 330k
R2_8 N050 N061 330k
R3_8 N018 N029 330k
Q1 N086 N091 0 0 MMBT2222A
R1 N077 N086 33k
R2 N068 N077 4.7k
Q12 N073 N076 0 0 MMBT2222A
R21 N065 N073 10k
R22 out_1 N065 100k
R23 N091 N090 22k
Vcell11 N063 N071 {vcell}
Q13 N068 N065 out_1 0 MMBT2907A
X§S3 out_neg N077 N071 IRLB8721  ; pins D G S
R24 N076 VcOFF 22k
Rout1 out_1 N063 1m
X§Sgnd1 N071 N077 0 IRLB8721  ; pins D G S
Q14 N085 P006 0 0 MMBT2222A
R25 N075 N085 1k
R26 VcOFF P006 22k
D1 Vcc N075 D
RL out_pos out_neg 47
X§M1 N090 VcOFF Vcc AO3401A  ; pins D G S
X§M2 N090 VcOFF 0 AO3400  ; pins D G S
Vc Vcc 0 5
X§M3 N092 VcOFF Vcc AO3401A  ; pins D G S
X§M4 N092 VcOFF 0 AO3400  ; pins D G S
X§M5 N025 VcON Vcc AO3401A  ; pins D G S
X§M6 N025 VcON 0 AO3400  ; pins D G S
X§M7 N057 VcON Vcc AO3401A  ; pins D G S
X§M8 N057 VcON 0 AO3400  ; pins D G S
X§M9 N059 VcON Vcc AO3401A  ; pins D G S
X§M10 N059 VcON 0 AO3400  ; pins D G S
X§M11 N027 VcON Vcc AO3401A  ; pins D G S
X§M12 N027 VcON 0 AO3400  ; pins D G S
.model D D
.lib standard.dio
.model NPN NPN
.model PNP PNP
.lib standard.bjt
* .tran 0 40m 0 10u
.MODEL MMBT2222A  NPN (IS=25.4f NF=1.00 BF=274 VAF=114 IKF=0.121 ISE=14.3p NE=2.00 BR=4.00 NR=1.00 VAR=24.0 IKR=0.300 RE=0.219 RB=0.877 RC=87.7m XTB=1.5 CJE=27.6p VJE=1.10 MJE=0.500 CJC=14.2p VJC=0.300 MJC=0.300 TF=622p TR=124n EG=1.12)
.MODEL MMBT2907A  PNP (IS=60.7f NF=1.00 BF=312 VAF=139 IKF=0.219 ISE=26.0p NE=2.00 BR=4.00 NR=1.00 VAR=20.0 IKR=0.540 RE=85.8m RB=0.343 RC=34.3m XTB=1.5 CJE=50.4p VJE=1.10 MJE=0.500 CJC=23.1p VJC=0.300 MJC=0.300 TF=758p TR=123n EG=1.12)
.model AONS32304 VDMOS(Kp=239 Rs=0.42m Rd=1.2m Rg=3.0 Vto=2.16 VtoTc=-2.8m Bex=-2.07 mtriode=1.1 Ksubthres=0.1 Lambda=0.158 Cgdmax=1420p Cgdmin=288p Cgs=5352p tt=19n A=0.7 Is=2.35E-11 N=1.017 Eg=1.07 Rb=0.1m Trb1=-1 BV=33 IBV=250u M=0.456 Vj=0.56 Cjo=1090.0pF mfg=AOS Vds=30 Ron=1.8m Qg=40n)
.model MMBFJ201 NJF(BETA=0.000896 IS=3E-12 VTO=-0.794 LAMBDA=0.02 RD=0.001 RS=0.0013)
.inc AO3401A.sub
.inc IRLB8721.sub
.inc 1N4736A.sub
.inc FDMS6681Z.lib
.inc 1N4730A.sub
.model LED_RED D(Is=2e-9 N=2.2 Rs=10 Bv=5 Ibv=0.1 Cjo=20p M=0.4 Vj=0.65)
.inc irlml6402.spi
.include AO3400.lib
.include AO3401A.sub
.op
* .step param vcell 2.5 3.65 0.1
.step param vcell list 2.5 2.8 3.0 3.2 3.3 3.45 3.65
.backanno
.end